# EAGLE design tm-motor-driver (EAGLE 7.6.0)
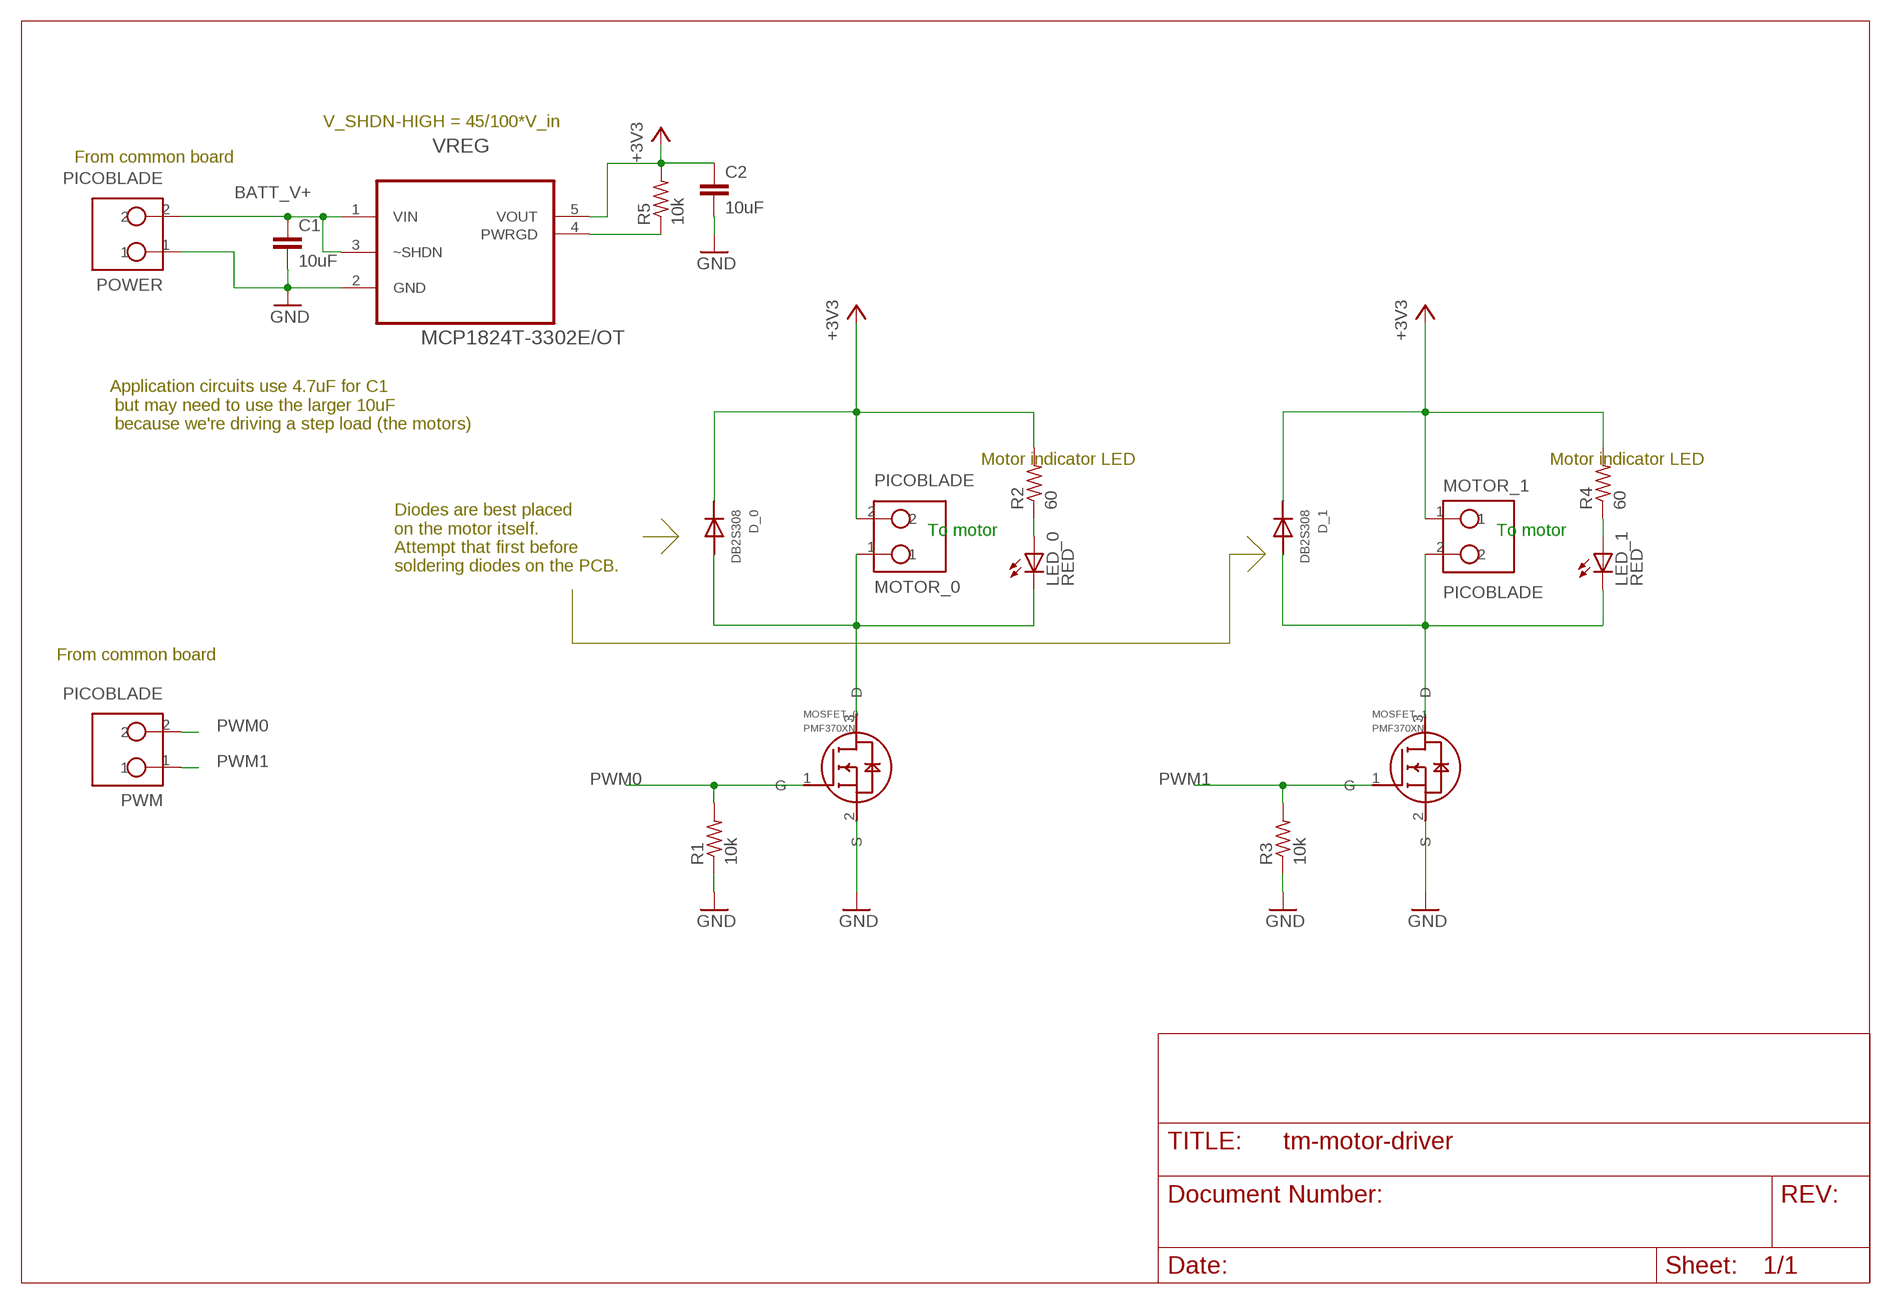
[diagram p0: schematic, sheet 1]

## Parts
C1  10uF  C-EUC0805  [C0805]
C2  10uF  C-EUC0805  [C0805]
D_0  DB2S308  [SOD-523]
D_1  DB2S308  [SOD-523]
LED_0  RED  LEDCHIPLED_0805  [CHIPLED_0805]
LED_1  RED  LEDCHIPLED_0805  [CHIPLED_0805]
MOSFET_0  PMF370XN  [SOT323(SC-70)]
MOSFET_1  PMF370XN  [SOT323(SC-70)]
MOTOR_0  PICOBLADE  [PICOBLADE]
MOTOR_1  PICOBLADE  [PICOBLADE]
POWER  PICOBLADE  [PICOBLADE]
PWM  PICOBLADE  [PICOBLADE]
R1  10k  R-US_R0805  [R0805]
R2  60  R-US_R0805  [R0805]
R3  10k  R-US_R0805  [R0805]
R4  60  R-US_R0805  [R0805]
R5  10k  R-US_R0805  [R0805]
VREG  MCP1824T-3302E/OT  [SOT95P270X145-5N]

## Nets
+3V3: C2.1 D_0.1(CATHODE) D_1.1(CATHODE) MOTOR_0.2 MOTOR_1.1 R2.2 R4.2 R5.2 VREG.5(VOUT)
BATT_V+: C1.1 POWER.2 VREG.1(VIN) VREG.3(~SHDN)
GND: C1.2 C2.2 MOSFET_0.2(S) MOSFET_1.2(S) POWER.1 R1.1 R3.1 VREG.2(GND)
N$1: D_1.2(ANODE) LED_1.C MOSFET_1.3(D) MOTOR_1.2
N$2: D_0.2(ANODE) LED_0.C MOSFET_0.3(D) MOTOR_0.1
N$3: LED_0.A R2.1
N$4: LED_1.A R4.1
N$7: R5.1 VREG.4(PWRGD)
PWM0: MOSFET_0.1(G) PWM.2 R1.2
PWM1: MOSFET_1.1(G) PWM.1 R3.2

## Notes on the sheet
- V_SHDN-HIGH = 45/100*V_in
- From common board
- Application circuits use 4.7uF for C1
   but may need to use the larger 10uF
   because we're driving a step load (the motors)
- Motor indicator LED | Motor indicator LED
- To motor | To motor
- Diodes are best placed 
  on the motor itself. 
  Attempt that first before 
  soldering diodes on the PCB.
- From common board

## Library data of the parts
C1 C2 = rcl:C-EU: CAPACITOR, European symbol
D_0 D_1 = tactile-music:DB2S308: Panasonic's DB2S308 Schottky Diode
LED_0 LED_1 = led:LED: LED OSRAM: - CHIPLED LG R971, LG N971, LY N971, LG Q971, LY Q971, LO R971, LY R971 LH N974, LH R974 LS Q976, LO Q976, LY Q976 LO Q996 - Hyper CHIPLED LW Q18S LB Q993, LB Q99A, LB R99A - SideLED LS A670, LO A670, LY A670, LG A670, LP A670 LB A673, LV A673, LT A673, LW A673 LH A674 LY A675 LS A676, LA A676, LO A676, LY A676, LW A676 LS A679, LY A679, LG A679 - Hyper Micro SIDELED® LS Y876, LA Y876, LO Y876, LY Y876 LT Y87S - SmartLED LW L88C, LW L88S LB L89C, LB L89S, LG L890 LS L89K, LO L89K, LY L89K LS L896, LA L896, LO L896, LY L896 - TOPLED LS T670, LO T670, LY T670, LG T670, LP T670 LSG T670, LSP T670, LSY T670, LOP T670, LYG T670 LG T671, LOG T671, LSG T671 LB T673, LV T673, LT T673, LW T673 LH T674 LS T676, LA T676, LO T676, LY T676, LB T676, LH T676, LSB T676, LW T676 LB T67C, LV T67C, LT T67C, LS T67K, LO T67K, LY T67K, LW E67C LS E67B, LA E67B, LO E67B, LY E67B, LB E67C, LV E67C, LT E67C LW T67C LS T679, LY T679, LG T679 LS T770, LO T770, LY T770, LG T770, LP T770 LB T773, LV T773, LT T773, LW T773 LH T774 LS E675, LA E675, LY E675, LS T675 LS T776, LA T776, LO T776, LY T776, LB T776 LHGB T686 LT T68C, LB T68C - Hyper Mini TOPLED® LB M676 - Mini TOPLED Santana® LG M470 LS M47K, LO M47K, LY M47K Source: http://www.osram.convergy.de LUXEON: - LUMILED® LXK2-PW12-R00, LXK2-PW12-S00, LXK2-PW14-U00, LXK2-PW14-V00 LXK2-PM12-R00, LXK2-PM12-S00, LXK2-PM14-U00 LXK2-PE12-Q00, LXK2-PE12-R00, LXK2-PE12-S00, LXK2-PE14-T00, LXK2-PE14-U00 LXK2-PB12-K00, LXK2-PB12-L00, LXK2-PB12-M00, LXK2-PB14-N00, LXK2-PB14-P00, LXK2-PB14-Q00 LXK2-PR12-L00, LXK2-PR12-M00, LXK2-PR14-Q00, LXK2-PR14-R00 LXK2-PD12-Q00, LXK2-PD12-R00, LXK2-PD12-S00 LXK2-PH12-R00, LXK2-PH12-S00 LXK2-PL12-P00, LXK2-PL12-Q00, LXK2-PL12-R00 Source: www.luxeon.com KINGBRIGHT: KA-3528ASYC Source: www.kingbright.com
MOSFET_0 MOSFET_1 = tactile-music:PMF370XN: MOSFET
MOTOR_0 MOTOR_1 POWER PWM = tactile-music:PICOBLADE: PICOBLADE connector
R1-R5 = resistor:R-US_: RESISTOR, American symbol
VREG = tactile-music:MCP1824T-3302E/OT: 300 mA, Low Voltage, Low Quiescent Current LDO Regulator; MPN: MCP1824T-3302E/OT; OC_FARNELL: 1578387; OC_NEWARK: 40M0704; PACKAGE: SOT23-5; SUPPLIER: Microchip

## Board
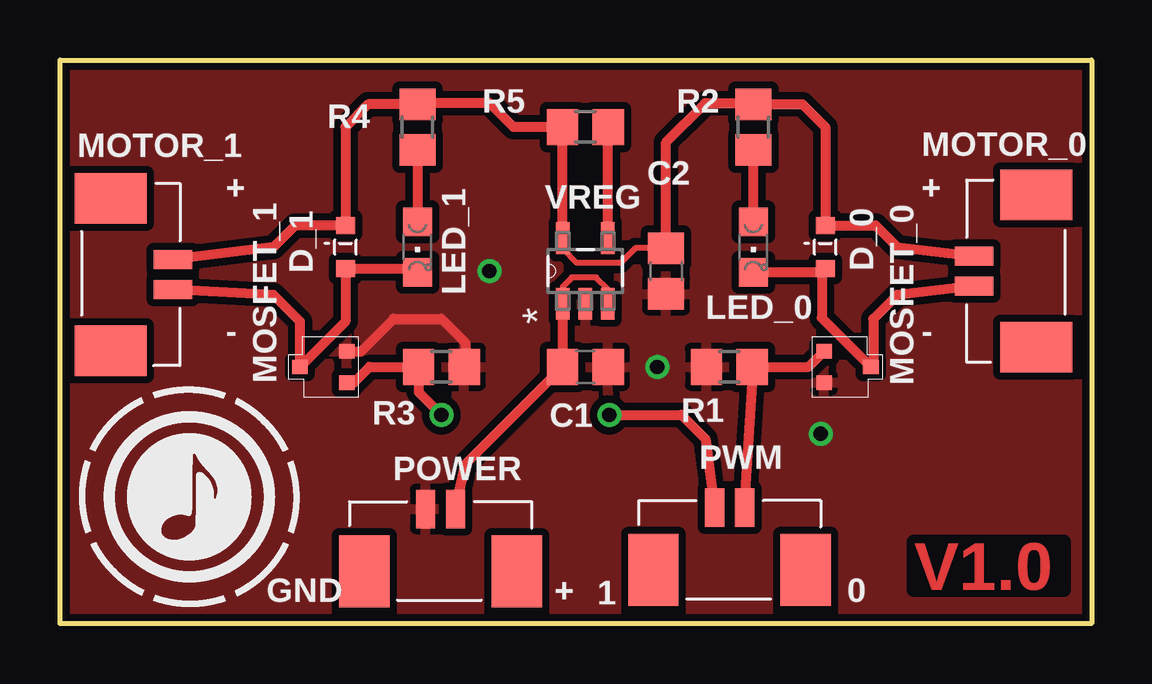
[diagram p1: board, top side]
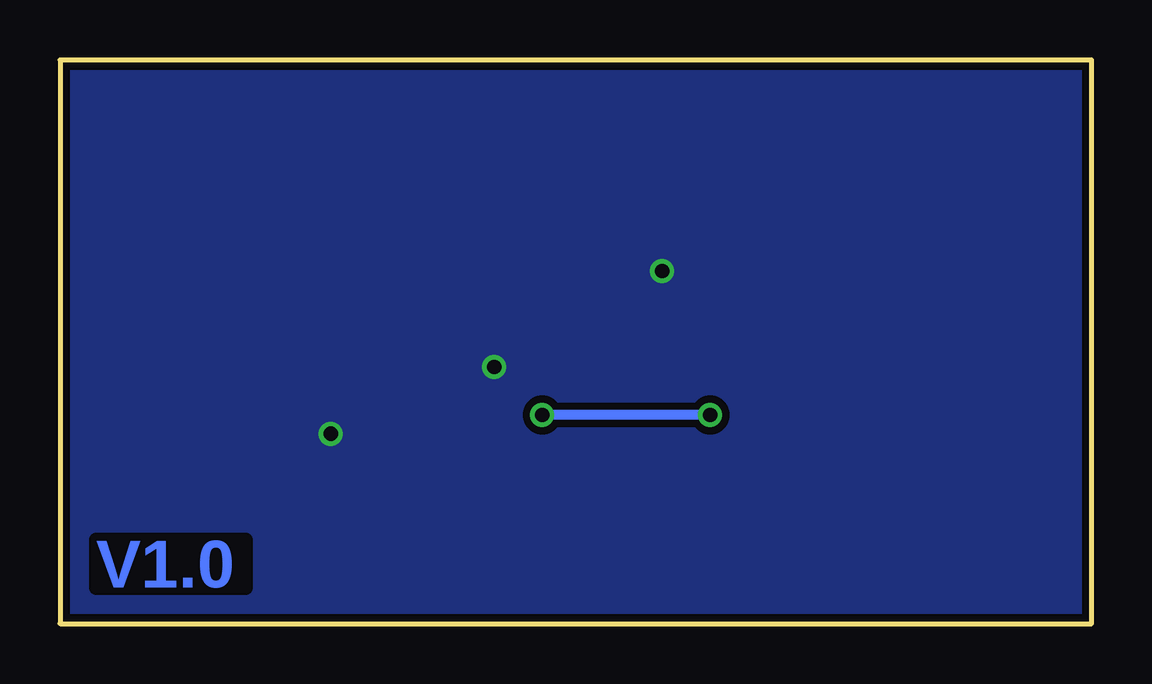
[diagram p2: board, bottom side, seen from below]

Size 43 x 23.5 mm. Coordinates in mm from the lower left corner, seen from the top.
Outline: 0,0 0,23.5 43,23.5 43,0 0,0
Copper layers (1*16): Top 0.035mm / dielectric 1.5mm / Bottom 0.035mm
Design rules "default *": minimum track width 10mil, minimum drill 0.5mm, track to track 8mil, track to pad 8mil, pad to pad 8mil, via to via 8mil, smd to smd 8mil, copper to edge 10mil, drill to drill 10mil, minimum pad ring 10mil, minimum via ring 8mil, stop-mask expansion 4mil, vias tented up to drill 0mil, thermal gap 10mil

### Footprints (pad centres in the part's own frame; a part is rotated, then mirrored left to right if it is on the bottom)
C0805 = smd 1.3 x 1.5: 1 -0.95,0; 2 0.95,0
SOD-523 = smd 0.8 x 0.7: 1 0,-0.9; 2 0,0.9
CHIPLED_0805 = smd 1.2 x 1.2: A 0,-1.05; C 0,1.05
SOT323(SC-70) = smd 0.65 x 0.6: 1 1.05,-0.65; 2 1.05,0.65; 3 -0.9,0
PICOBLADE = smd 0.8 x 1.6: 1 -0.625,1.8; 2 0.625,1.8 | smd 2.1 x 3: P$1 -3.175,-0.8; P$2 3.175,-0.8
R0805 = smd 1.3 x 1.5: 1 -0.95,0; 2 0.95,0
SOT95P270X145-5N = smd 1.321 x 0.559: 1 -1.372,0.94; 2 -1.372,0; 3 -1.372,-0.94; 4 1.372,-0.94; 5 1.372,0.94

### Placement (x,y rotation side)
C1  21.9,10.7 0 top
C2  25.27,14.7 270 top
D_0  31.9,15.7 180 top
D_1  11.9,15.7 180 top
LED_0  28.9,15.7 180 top
LED_1  14.9,15.7 180 top
MOSFET_0  32.9,10.7 180 top
MOSFET_1  10.9,10.7 0 top
MOTOR_0  39.9,14.7 90 top
MOTOR_1  2.9,14.55 270 top
POWER  15.86,2.98 0 top
PWM  27.92,3.03 0 top
R1  27.9,10.7 0 top
R2  28.9,20.7 90 top
R3  15.9,10.7 180 top
R4  14.9,20.7 90 top
R5  21.9,20.7 180 top
VREG  21.9,14.7 90 top

### Tracks (layer width: path | path; a pad name or v marks a point on that pad's centre or on a via)
+3V3
  Top 0.254: C2.1 23.98,15.65 23.37,15.04 21.54,15.04 20.96,15.62 VREG.5
  Top 0.406: VREG.5 R5.2 18.9,20.7 17.9,21.7 14.95,21.7 R4.2 12.85,21.65 11.9,20.7 D_1.1 9.8,16.6 8.9,15.7 MOTOR_1.1 | MOTOR_0.2 34.9,15.7 34,16.6 D_0.1 31.9,20.7 30.95,21.65 R2.2 28.85,21.7 26.9,21.7 25.27,20.07 C2.1
BATT_V+
  Top 0.254: VREG.3 22.84,13.94 22.35,14.43 21.34,14.43 20.96,14.05 VREG.1
  Top 0.406: VREG.1 C1.1 16.9,6.65 POWER.2
GND  (via drill 0.6)
  Top 0.406: MOSFET_1.2 12.55,11.35 13.9,12.7 15.9,12.7 16.9,11.7 16.9,10.75 R3.1
  other vias: 17.9,14.7 24.9,10.7 31.72,7.91
  pour Top (isolate 0.305): 0,0 0,23.9 44.4,23.8 44.4,-0.1
  pour Bottom (isolate 0.305): 0,0 0,23.9 44.3,23.9 44.3,0
N$1
  Top 0.406: LED_1.C 14.75,14.8 D_1.2 11.9,12.6 MOSFET_1.3 10,12.6 8.9,13.7 MOTOR_1.2
N$2
  Top 0.406: LED_0.C 31.75,14.65 | 31.75,14.65 D_0.2 | 31.75,14.65 31.75,12.75 MOSFET_0.3 33.9,10.8 33.9,12.7 34.9,13.7 MOTOR_0.1
N$3
  Top 0.406: LED_0.A R2.1
N$4
  Top 0.406: R4.1 LED_1.A
N$7
  Top 0.406: VREG.4 R5.1
PWM0
  Top 0.406: PWM.2 28.9,10.65 R1.2 31.2,10.7 MOSFET_0.1
PWM1  (via drill 0.6)
  Top 0.406: MOSFET_1.1 12.25,10.05 12.9,10.7 R3.2 14.95,9.65 v15.9,8.7 | v22.9,8.7 25.9,8.7 26.9,7.7 PWM.1
  Bottom 0.406: v15.9,8.7 v22.9,8.7

### Text on the board
Top: V1.0
Bottom: V1.0
tPlace: + | + | - | - | GND | + | 1 | 0
200bmp: C:/EAGLE-7.6.0/lbr/tactile-music-hw-lib/ICON.bmp